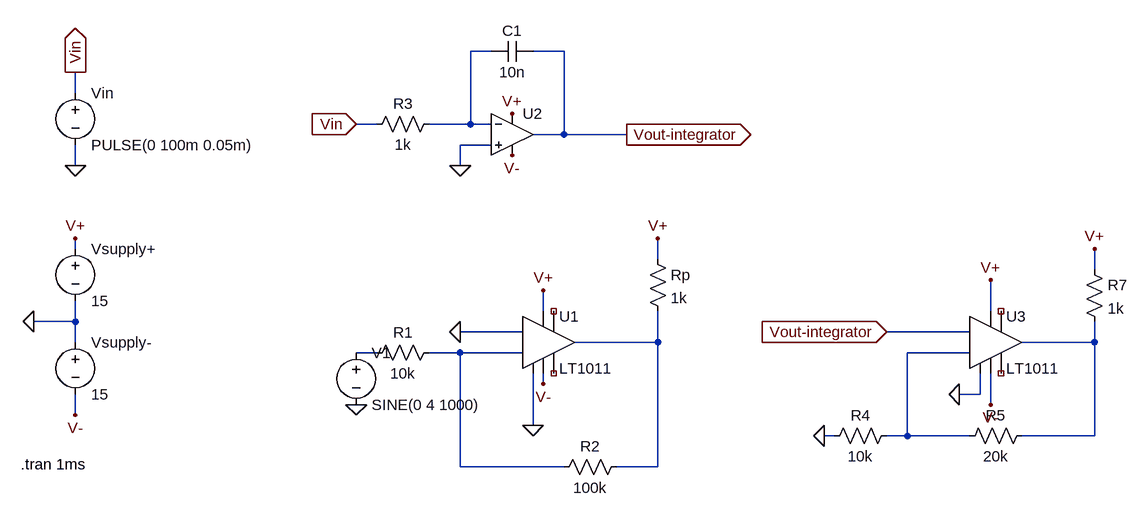
[diagram p0: schematic essai-vco.asc]
essai-vco.asc, the LTspice schematic file:
Version 4
SHEET 1 1732 680
WIRE 592 -272 560 -272
WIRE 704 -272 656 -272
WIRE -48 -208 -48 -240
WIRE 416 -160 384 -160
WIRE 560 -160 560 -272
WIRE 560 -160 496 -160
WIRE 592 -160 560 -160
WIRE 704 -144 704 -272
WIRE 704 -144 656 -144
WIRE 800 -144 704 -144
WIRE 592 -128 544 -128
WIRE -48 -96 -48 -128
WIRE 544 -96 544 -128
WIRE -48 32 -48 16
WIRE 848 48 848 16
WIRE 1520 64 1520 32
WIRE 672 128 672 96
WIRE 1360 128 1360 80
WIRE -48 144 -48 112
WIRE -48 144 -112 144
WIRE 640 160 544 160
WIRE 1328 160 1200 160
WIRE -48 176 -48 144
WIRE 848 176 848 128
WIRE 848 176 720 176
WIRE 1520 176 1520 144
WIRE 1520 176 1408 176
WIRE 416 192 384 192
WIRE 544 192 496 192
WIRE 640 192 544 192
WIRE 1328 192 1232 192
WIRE 672 240 672 224
WIRE 1344 256 1344 224
WIRE 1344 256 1312 256
WIRE 1360 272 1360 224
WIRE -48 288 -48 256
WIRE 656 304 656 224
WIRE 1120 320 1104 320
WIRE 1232 320 1232 192
WIRE 1232 320 1200 320
WIRE 1328 320 1232 320
WIRE 1520 320 1520 176
WIRE 1520 320 1408 320
WIRE 544 368 544 192
WIRE 704 368 544 368
WIRE 848 368 848 176
WIRE 848 368 784 368
FLAG -112 144 0
FLAG -48 16 V+
FLAG -48 288 V-
FLAG 624 -176 V+
FLAG 624 -112 V-
FLAG -48 -96 0
FLAG -48 -240 Vin
IOPIN -48 -240 Out
FLAG 384 -160 Vin
IOPIN 384 -160 In
FLAG 800 -144 Vout-integrator
IOPIN 800 -144 Out
FLAG 544 160 0
FLAG 656 304 0
FLAG 848 16 V+
FLAG 672 240 V-
FLAG 1200 160 Vout-integrator
IOPIN 1200 160 In
FLAG 672 96 V+
FLAG 1312 256 0
FLAG 1360 80 V+
FLAG 1360 272 V-
FLAG 1520 32 V+
FLAG 1104 320 0
FLAG 384 272 0
FLAG 544 -96 0
SYMBOL voltage -48 16 R0
WINDOW 123 0 0 Left 2
WINDOW 39 0 0 Left 2
SYMATTR InstName Vsupply+
SYMATTR Value 15
SYMBOL voltage -48 160 R0
WINDOW 123 0 0 Left 2
WINDOW 39 0 0 Left 2
SYMATTR InstName Vsupply-
SYMATTR Value 15
SYMBOL Opamps\\UniversalOpamp2 624 -144 R0
SYMATTR InstName U2
SYMBOL cap 656 -288 R90
WINDOW 0 0 32 VBottom 2
WINDOW 3 32 32 VTop 2
SYMATTR InstName C1
SYMATTR Value 10n
SYMBOL res 400 -144 R270
WINDOW 0 32 56 VTop 2
WINDOW 3 0 56 VBottom 2
SYMATTR InstName R3
SYMATTR Value 1k
SYMBOL voltage -48 -224 R0
WINDOW 123 0 0 Left 2
WINDOW 39 0 0 Left 2
SYMATTR InstName Vin
SYMATTR Value PULSE(0 100m 0.05m)
SYMBOL res 400 208 R270
WINDOW 0 32 56 VTop 2
WINDOW 3 0 56 VBottom 2
SYMATTR InstName R1
SYMATTR Value 10k
SYMBOL Comparators\\LT1011 672 176 R0
SYMATTR InstName U1
SYMBOL res 800 352 R90
WINDOW 0 0 56 VBottom 2
WINDOW 3 32 56 VTop 2
SYMATTR InstName R2
SYMATTR Value 100k
SYMBOL res 832 32 R0
SYMATTR InstName Rp
SYMATTR Value 1k
SYMBOL Comparators\\LT1011 1360 176 R0
SYMATTR InstName U3
SYMBOL res 1216 304 R90
WINDOW 0 0 56 VBottom 2
WINDOW 3 32 56 VTop 2
SYMATTR InstName R4
SYMATTR Value 10k
SYMBOL res 1424 304 R90
WINDOW 0 0 56 VBottom 2
WINDOW 3 32 56 VTop 2
SYMATTR InstName R5
SYMATTR Value 20k
SYMBOL res 1504 48 R0
SYMATTR InstName R7
SYMATTR Value 1k
SYMBOL voltage 384 176 R0
WINDOW 123 0 0 Left 2
WINDOW 39 0 0 Left 2
SYMATTR InstName V1
SYMATTR Value SINE(0 4 1000)
TEXT -132 364 Left 2 !.tran 1ms

The netlist it stands for:
* essai-vco.asc
Vsupply+ V+ 0 15
Vsupply- 0 V- 15
XU2 0 N001 V+ V- Vout-integrator level.2 Avol=1Meg GBW=10Meg Slew=10Meg ilimit=25m rail=0 Vos=0 phimargin=45 en=0 enk=0 in=0 ink=0 Rin=500Meg  ; pins IN+ IN- V+ V- OUT
C1 Vout-integrator N001 10n
R3 Vin N001 1k
Vin Vin 0 PULSE(0 100m 0.05m)
R1 N004 N005 10k
XU1 0 N005 0 V- NC_01 NC_02 N002 V+ LT1011
R2 N002 N005 100k
Rp V+ N002 1k
XU3 0 N006 Vout-integrator V- NC_03 NC_04 N003 V+ LT1011
R4 N006 0 10k
R5 N003 N006 20k
R7 V+ N003 1k
V1 N004 0 SINE(0 4 1000)
.tran 1ms
.lib UniversalOpamps2.sub
.lib LTC1.lib
.backanno
.end